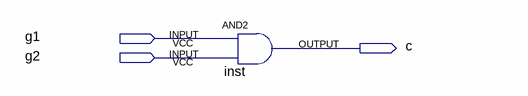
[diagram p0: schematic sheet]
// Quartus schematic and_prj1.bdf as structural Verilog: 1 symbols, 3 pins
module and_prj1 (
  input  g1,
  input  g2,
  output c
);

  and inst (c, g1, g2);
endmodule
